# EAGLE design SushiBitsOne (EAGLE 8.2.1)
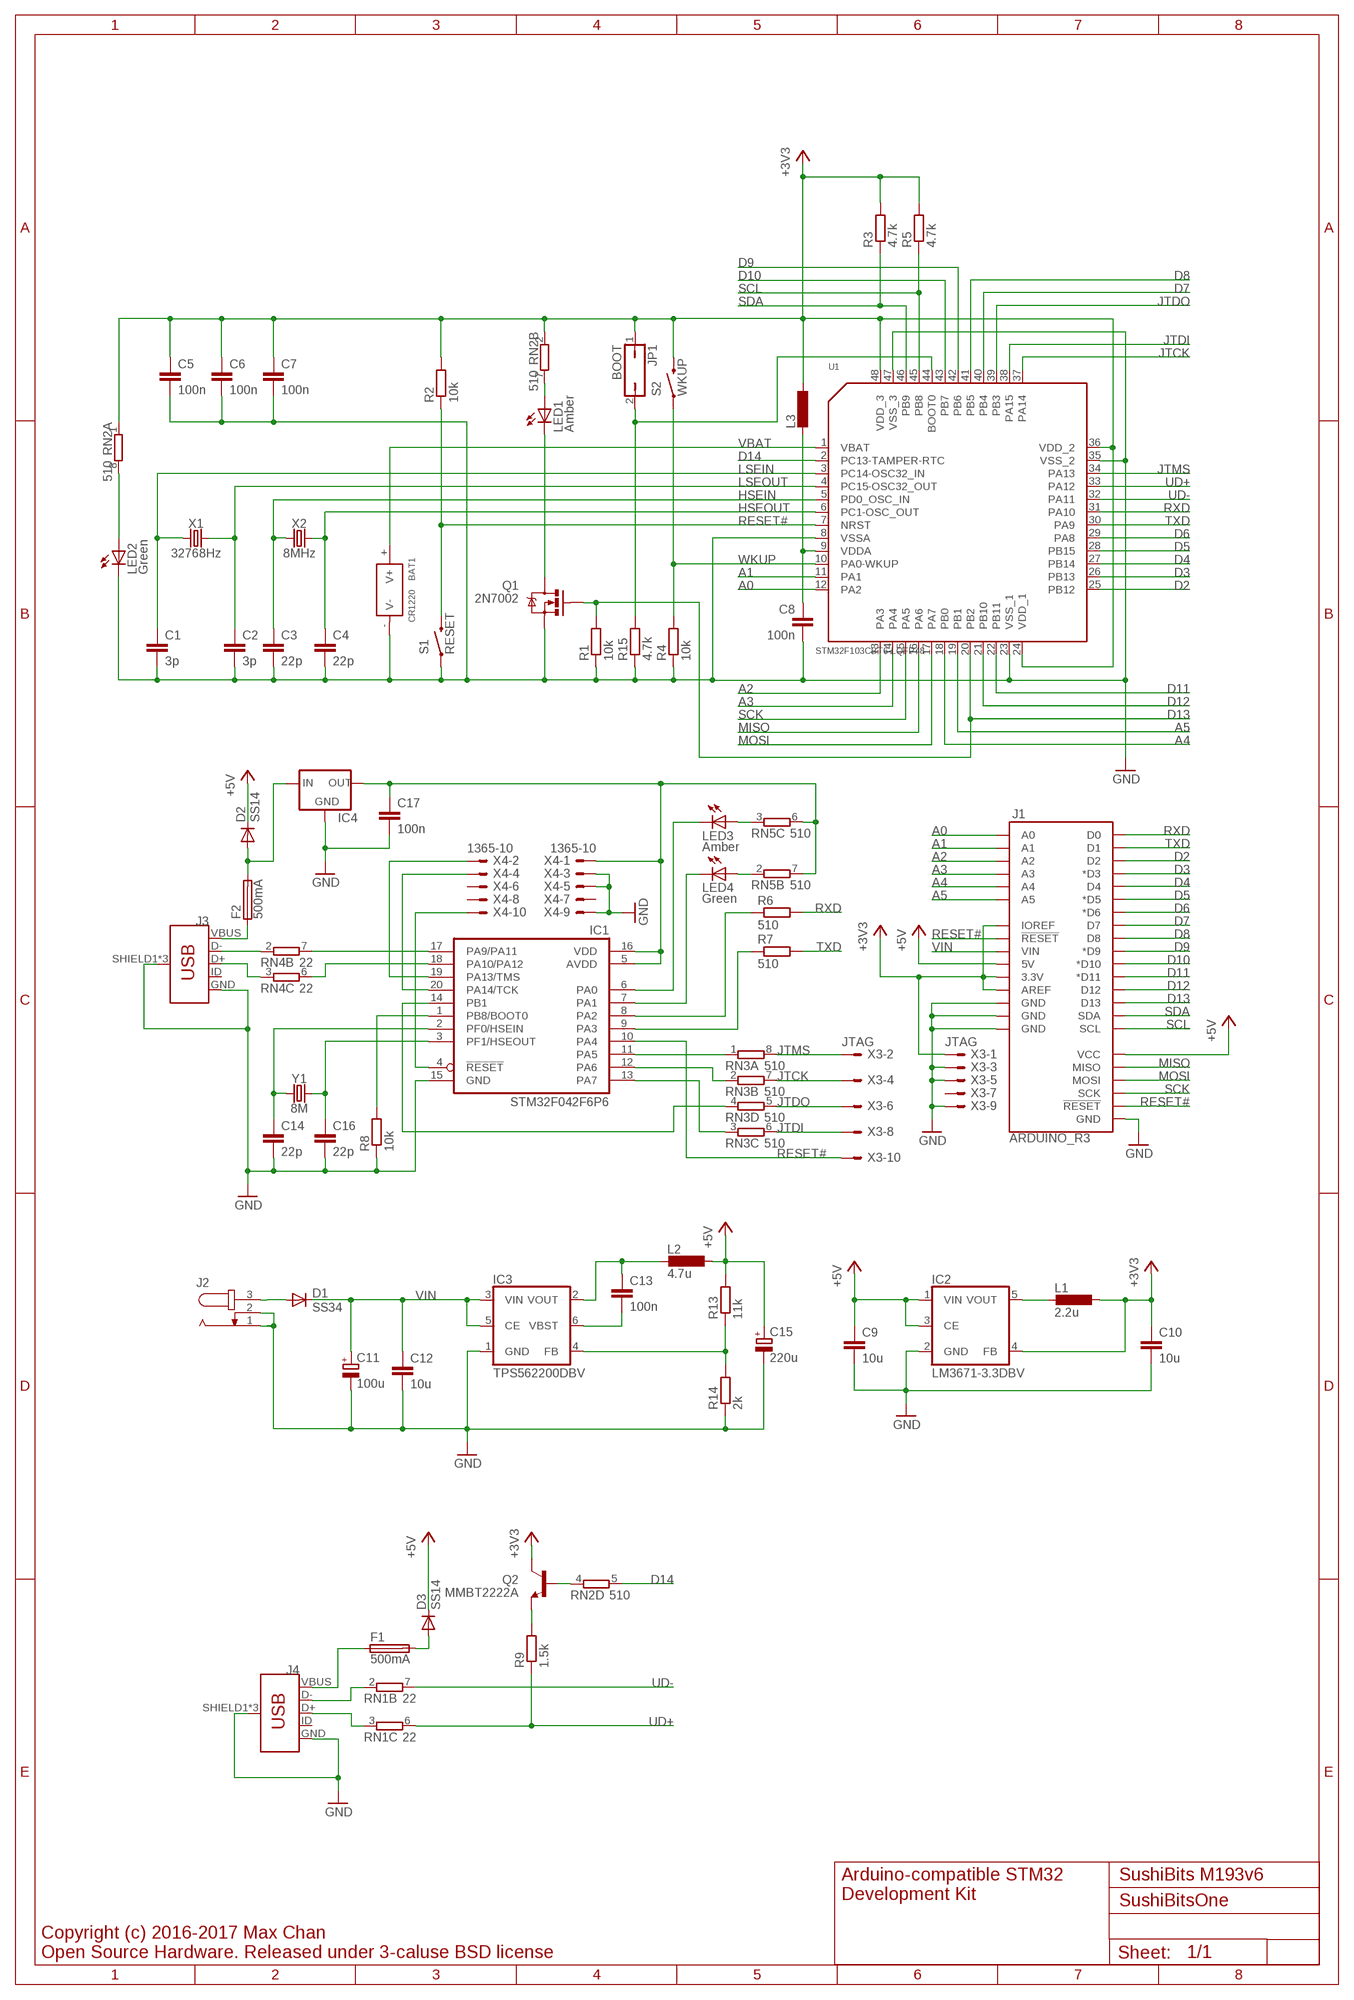
[diagram p0: schematic, sheet 1]

## Parts
BAT1  CR1220  SMD-BATTERY-CELL-HOLDER-PLASTIC  [BAT2P-SMD-16.4-CR1220]
C1  3p  C-EUC0603  [C0603]
C2  3p  C-EUC0603  [C0603]
C3  22p  C-EUC0603  [C0603]
C4  22p  C-EUC0603  [C0603]
C5  100n  C-EUC0603  [C0603]
C6  100n  C-EUC0603  [C0603]
C7  100n  C-EUC0603  [C0603]
C8  100n  C-EUC0603  [C0603]
C9  10u  C-EUC0805  [C0805]
C10  10u  C-EUC0805  [C0805]
C11  100u  CPOL-EUUD-8X10  [UD-8X10_NICHICON]
C12  10u  C-EUC0805  [C0805]
C13  100n  C-EUC0603  [C0603]
C14  22p  C-EUC0603  [C0603]
C15  220u  CPOL-EUSMCB  [SMC_B]
C16  22p  C-EUC0603  [C0603]
C17  100n  C-EUC0603  [C0603]
D1  SS34  DIODE-DO214AC  [DO214AC]
D2  SS14  DIODE-SOD123  [SOD123]
D3  SS14  DIODE-SOD123  [SOD123]
F1  500mA  FUSER0805  [R0805]
F2  500mA  FUSER0805  [R0805]
IC1  STM32F042F6P6  [TSSOP20]
IC2  LM3671-3.3DBV  [SOT23-5L]
IC3  TPS562200DBV  [SOT23-6L]
IC4  XC63FPM  [SOT23]
J1  ARDUINO_R3  [ARDUINO_R3]
J2  JACK-PLUG0  [SPC4077]
J3  USB_MICRO-B_FEMALE-SMT  [USB-B-MICRO-SMD]
J4  USB_MICRO-B_FEMALE-SMT  [USB-B-MICRO-SMD]
JP1  BOOT  JP1Q  [JP1]
L1  2.2u  L-EUL5650M  [L5650M]
L2  4.7u  L-EUL5650M  [L5650M]
L3  L-EUL2012C  [L2012C]
LED1  Amber  LEDCHIPLED_0805  [CHIPLED_0805]
LED2  Green  LEDCHIP-LED0805  [CHIP-LED0805]
LED3  Amber  LEDCHIP-LED0805  [CHIP-LED0805]
LED4  Green  LEDCHIP-LED0805  [CHIP-LED0805]
Q1  2N7002  MOSFET-NCHANNELBSS138  [SOT23-3]
Q2  MMBT2222A  TRANSISTOR_NPNMMBT2222A  [SOT23-3]
R1  10k  R-EU_R0603  [R0603]
R2  10k  R-EU_R0603  [R0603]
R3  4.7k  R-EU_R0603  [R0603]
R4  10k  R-EU_R0603  [R0603]
R5  4.7k  R-EU_R0603  [R0603]
R6  510  R-EU_R0603  [R0603]
R7  510  R-EU_R0603  [R0603]
R8  10k  R-EU_R0603  [R0603]
R9  1.5k  R-EU_R0603  [R0603]
R13  11k  R-EU_R0603  [R0603]
R14  2k  R-EU_R0603  [R0603]
R15  4.7k  R-EU_R0603  [R0603]
RN1  22  4R-NEXB38V  [EXB38V]
RN2  510  4R-NEXB38V  [EXB38V]
RN3  510  4R-NEXB38V  [EXB38V]
RN4  22  4R-NEXB38V  [EXB38V]
RN5  510  4R-NEXB38V  [EXB38V]
S1  RESET  SWITCH-MOMENTARY-2SMD-1101NE  [TACTILE-SWITCH-1101NE]
S2  WKUP  SWITCH-MOMENTARY-2SMD-1101NE  [TACTILE-SWITCH-1101NE]
U1  STM32F103CBT6-LQFP48  MCU-STM32F103CBT6(LQFP48)  [LQFP48-0.5-7X7MM]
X1  32768Hz  CRYSTALSMD-3.2X1.5  [CRYSTAL-SMD-3.2X1.5MM]
X2  8MHz  CRYSTALSMD-5X3.2-2PAD  [CRYSTAL-SMD-5X3.2-2PAD]
X3  JTAG  1365-10  [1365-10]
X4  1365-10  [1365-10]
Y1  8M  CRYSTALSMD-5X3.2-2PAD  [CRYSTAL-SMD-5X3.2-2PAD]

## Nets
+3V3: C5.1 C6.1 C7.1 C10.1 IC2.4(FB) J1.3.3V J1.AREF J1.IOREF JP1.1 L1.1 L3.1 Q2.3(C) R2.2 R3.2 R5.2 RN2.1 RN2.2 S2.2 U1.24(VDD_1) U1.36(VDD_2) U1.48(VDD_3) X3.1
+5V: C9.1 C15.+ D2.C D3.C IC2.1(VIN) IC2.3(CE) J1.5V J1.VCC L2.1 R13.2
A0: J1.A0 U1.12(PA2)
A1: J1.A1 U1.11(PA1)
A2: J1.A2 U1.13(PA3)
A3: J1.A3 U1.14(PA4)
A4: J1.A4 U1.18(PB0)
A5: J1.A5 U1.19(PB1)
D2: J1.D2 U1.25(PB12)
D3: J1.D3(*D3) U1.26(PB13)
D4: J1.D4 U1.27(PB14)
D5: J1.D5(*D5) U1.28(PB15)
D6: J1.D6(*D6) U1.29(PA8)
D7: J1.D7 U1.40(PB4)
D8: J1.D8 U1.41(PB5)
D9: J1.D9(*D9) U1.42(PB6)
D10: J1.D10(*D10) U1.43(PB7)
D11: J1.D11(*D11) U1.22(PB11)
D12: J1.D12 U1.21(PB10)
D13: J1.D13 Q1.1(G) R1.2 U1.20(PB2)
D14: RN2.5 U1.2(PC13-TAMPER-RTC)
GND: BAT1.-(V-) C1.2 C2.2 C3.2 C4.2 C5.2 C6.2 C7.2 C8.2 C9.2 C10.2 C11.- C12.2 C14.2 C15.- C16.2 C17.2 IC1.15(GND) IC2.2(GND) IC3.1(GND) IC4.1(GND) J1.GND@1(GND) J1.GND@2(GND) J1.GND@3(GND) J1.GND@4(GND) J2.1 J2.2 J3.GND J3.SHIELD1(SHIELD) J3.SHIELD2(SHIELD) J3.SHIELD3(SHIELD) J4.GND J4.SHIELD1(SHIELD) J4.SHIELD2(SHIELD) J4.SHIELD3(SHIELD) LED2.C Q1.2(S) R1.1 R4.1 R8.1 R14.1 R15.1 S1.1 U1.8(VSSA) U1.23(VSS_1) U1.35(VSS_2) U1.47(VSS_3) X3.3 X3.5 X3.9 X4.3 X4.5 X4.9
HSEIN: C3.1 U1.5(PD0_OSC_IN) X2.P$1
HSEOUT: C4.1 U1.6(PC1-OSC_OUT) X2.P$2
JTCK: RN3.7 U1.37(PA14) X3.4
JTDI: RN3.6 U1.38(PA15) X3.8
JTDO: RN3.5 U1.39(PB3) X3.6
JTMS: RN3.8 U1.34(PA13) X3.2
LSEIN: C1.1 U1.3(PC14-OSC32_IN) X1.P$1
LSEOUT: C2.1 U1.4(PC15-OSC32_OUT) X1.P$2
MISO: J1.MISO U1.16(PA6)
MOSI: J1.MOSI U1.17(PA7)
N$1: J4.D- RN1.2
N$2: J4.D+ RN1.3
N$3: IC1.17(PA9/PA11) RN4.7
N$4: IC1.18(PA10/PA12) RN4.6
N$5: IC1.8(PA2) R6.1
N$6: IC1.9(PA3) R7.1
N$7: LED2.A RN2.8
N$8: LED1.C Q1.3(D)
N$9: LED1.A RN2.7
N$10: IC2.5(VOUT) L1.2
N$11: D1.A J2.3
N$12: JP1.2 R15.2 U1.44(BOOT0)
N$13: D3.A F1.2
N$14: C13.1 IC3.2(VOUT) L2.2
N$15: C13.2 IC3.6(VBST)
N$16: D2.A F2.2 IC4.3(IN)
N$17: IC3.4(FB) R13.1 R14.2
N$18: Q2.2(E) R9.2
N$19: Q2.1(B) RN2.4
N$20: C8.1 L3.2 U1.9(VDDA)
N$21: IC1.4(!RESET) X4.10
N$22: J3.D+ RN4.3
N$23: J3.D- RN4.2
N$24: F2.1 J3.VBUS
N$25: IC1.20(PA14/TCK) X4.4
N$26: IC1.19(PA13/TMS) X4.2
N$27: C17.1 IC1.5(AVDD) IC1.16(VDD) IC4.2(OUT) RN5.6 RN5.7 X4.1
N$28: C14.1 IC1.2(PF0/HSEIN) Y1.P$1
N$29: C16.1 IC1.3(PF1/HSEOUT) Y1.P$2
N$30: IC1.11(PA5) RN3.1
N$31: IC1.12(PA6) RN3.2
N$32: IC1.13(PA7) RN3.3
N$33: IC1.14(PB1) RN3.4
N$34: IC1.1(PB8/BOOT0) R8.2
N$35: IC1.6(PA0) LED3.C
N$36: IC1.7(PA1) LED4.C
N$37: LED4.A RN5.2
N$38: LED3.A RN5.3
RESET#: IC1.10(PA4) J1.RESET@1(!RESET!) J1.RESET@2(!RESET!) R2.1 S1.2 U1.7(NRST) X3.10
RXD: J1.D0 R6.2 U1.31(PA10)
SCK: J1.SCK U1.15(PA5)
SCL: J1.SCL R5.1 U1.45(PB8)
SDA: J1.SDA R3.1 U1.46(PB9)
TXD: J1.D1 R7.2 U1.30(PA9)
UD+: R9.1 RN1.6 U1.33(PA12)
UD-: RN1.7 U1.32(PA11)
VBAT: BAT1.+(V+) U1.1(VBAT)
VBUS2: F1.1 J4.VBUS
VIN: C11.+ C12.1 D1.C IC3.3(VIN) IC3.5(CE) J1.VIN
WKUP: R4.2 S2.1 U1.10(PA0-WKUP)
Unconnected: J3.ID J4.ID RN1.1 RN1.4 RN1.5 RN1.8 RN2.3 RN2.6 RN4.1 RN4.4 RN4.5 RN4.8 RN5.1 RN5.4 RN5.5 RN5.8 X3.7 X4.6 X4.7 X4.8

## Notes on the sheet
- Arduino-compatible STM32
  Development Kit
- SushiBits M193v6
- Copyright (c) 2016-2017 Max Chan
  Open Source Hardware. Released under 3-caluse BSD license

## Library data of the parts
BAT1 = Seeed-OPL-Connector:SMD-BATTERY-CELL-HOLDER-PLASTIC: 320170000
C1-C10 C12-C14 C16 C17 = rcl:C-EU: CAPACITOR, European symbol
C11 C15 = rcl:CPOL-EU: POLARIZED CAPACITOR, European symbol
D1-D3 = diode:DIODE-: DIODE
F1 F2 = fuse:FUSE: Fuse
IC1 = HeadphoneBT:STM32F042F
IC2 = stm32f103c-dvk2:LM3671
IC3 = stm32f103c-dvk2:TPS56*200
IC4 = v-reg:XC63FP: Positiv Voltage Regulators www.torex.co.jp/english/product/pro02/pdf/0201_xc62fp.pdf
J1 = SparkFun-Boards:ARDUINO_R3: Arduino R3 Footprint (w/ SPI header)
J2 = con-jack:JACK-PLUG: DC POWER JACK Power Jack, DC, Right Angle, Through Hole, Rated 5A at 16VDC, PC Terminals Distributor: Farnell (www.Farnell.de) Drawing: 84N1161.pdf / 84N1162.pdf Manufacturer: SPC Technology (www.spctechnology.com) Type: SPC4077 / SPC 4078; OC_FARNELL: unknown; OC_NEWARK: unknown
J3 J4 = SparkFun-Connectors:USB_MICRO-B: USB Type Micro-B Connector Male/female and PTH/SMT variants SparkFun Products: SparkFun microB USB Breakout <https://www.sparkfun.com/products/12035> SparkFun USB microB Plug Breakout <https://www.sparkfun.com/products/10031> SparkFun ESP8266 Thing <https://www.sparkfun.com/products/13231>; PROD_ID: CONN-11752
JP1 = jumper:JP1Q: JUMPER
L1-L3 = rcl:L-EU: INDUCTOR, European symbol
LED1-LED4 = led:LED: LED OSRAM: - CHIPLED LG R971, LG N971, LY N971, LG Q971, LY Q971, LO R971, LY R971 LH N974, LH R974 LS Q976, LO Q976, LY Q976 LO Q996 - Hyper CHIPLED LW Q18S LB Q993, LB Q99A, LB R99A - SideLED LS A670, LO A670, LY A670, LG A670, LP A670 LB A673, LV A673, LT A673, LW A673 LH A674 LY A675 LS A676, LA A676, LO A676, LY A676, LW A676 LS A679, LY A679, LG A679 - Hyper Micro SIDELED® LS Y876, LA Y876, LO Y876, LY Y876 LT Y87S - SmartLED LW L88C, LW L88S LB L89C, LB L89S, LG L890 LS L89K, LO L89K, LY L89K LS L896, LA L896, LO L896, LY L896 - TOPLED LS T670, LO T670, LY T670, LG T670, LP T670 LSG T670, LSP T670, LSY T670, LOP T670, LYG T670 LG T671, LOG T671, LSG T671 LB T673, LV T673, LT T673, LW T673 LH T674 LS T676, LA T676, LO T676, LY T676, LB T676, LH T676, LSB T676, LW T676 LB T67C, LV T67C, LT T67C, LS T67K, LO T67K, LY T67K, LW E67C LS E67B, LA E67B, LO E67B, LY E67B, LB E67C, LV E67C, LT E67C LW T67C LS T679, LY T679, LG T679 LS T770, LO T770, LY T770, LG T770, LP T770 LB T773, LV T773, LT T773, LW T773 LH T774 LS E675, LA E675, LY E675, LS T675 LS T776, LA T776, LO T776, LY T776, LB T776 LHGB T686 LT T68C, LB T68C - Hyper Mini TOPLED® LB M676 - Mini TOPLED Santana® LG M470 LS M47K, LO M47K, LY M47K Source: http://www.osram.convergy.de LUXEON: - LUMILED® LXK2-PW12-R00, LXK2-PW12-S00, LXK2-PW14-U00, LXK2-PW14-V00 LXK2-PM12-R00, LXK2-PM12-S00, LXK2-PM14-U00 LXK2-PE12-Q00, LXK2-PE12-R00, LXK2-PE12-S00, LXK2-PE14-T00, LXK2-PE14-U00 LXK2-PB12-K00, LXK2-PB12-L00, LXK2-PB12-M00, LXK2-PB14-N00, LXK2-PB14-P00, LXK2-PB14-Q00 LXK2-PR12-L00, LXK2-PR12-M00, LXK2-PR14-Q00, LXK2-PR14-R00 LXK2-PD12-Q00, LXK2-PD12-R00, LXK2-PD12-S00 LXK2-PH12-R00, LXK2-PH12-S00 LXK2-PL12-P00, LXK2-PL12-Q00, LXK2-PL12-R00 Source: www.luxeon.com KINGBRIGHT: KA-3528ASYC Source: www.kingbright.com
Q1 = SparkFun-DiscreteSemi:MOSFET-NCHANNEL: Common NMOSFET Parts MFG P/N Store ID Prod ID FDD8780 TRANS-09984 SI7820DN TRANS-11055 FDS6630A IC-08089 2N7002PW TRANS-11151 FQP30N06L COM-10213 TRANS-10060 BSS123LT1G TRANS-08345 BSS138 TRANS-00830 BS170 2N7000; PROD_ID: TRANS-00830; VALUE: 200mA/50V
Q2 = SparkFun-DiscreteSemi:TRANSISTOR_NPN: Generic NPN BJT MMBT2222A - TRANS-08049 (SOT-23, 1A 40V) MPSA42 - TRANS-09116 (SOT-23, 500mA 300V) MMBT5088LT1G - TRANS-11160 (SOT-23, 50 mA 30V) BC547 - COM-08928 <http://www.sparkfun.com/products/8928> (TO-92 45V 100mA) (1.Collector 2.Base 3.Emitter) 2N3904 - COM-00521 <http://www.sparkfun.com/products/521> (TO-92 40V 200mA) (1.Emitter 2.Base 3.Collector) P2N2222A - COM-12852 <http://www.sparkfun.com/products/12852> (TO-92 40V 600mA) (1.Collector 2.Base 3.Emitter); PROD_ID: TRANS-08049
R1-R9 R13-R15 = rcl:R-EU_: RESISTOR, European symbol
RN1-RN5 = resistor-dil:4R-N: Array Chip Resistor Source: RS Component / Phycomp; OC_FARNELL: unknown; OC_NEWARK: unknown
S1 S2 = SparkFun-Electromechanical:SWITCH-MOMENTARY-2: Various NO switches- pushbuttons, reed, etc; PROD_ID: SWCH-00815
U1 = Seeed-OPL-ic:MCU-STM32F103CBT6(LQFP48): 310010004; MPN: STM32F103CBT6
X1 X2 Y1 = SparkFun-Clocks:CRYSTAL: Crystals (Generic) These are passive quartz crystals, which can be used as a clock source for a microcontroller. Crystal's are two-terminal devices. They require external "load" capacitors to generate an oscillating signal.
X3 X4 = con-leotronics:1365-10: DUAL ROW STRAIGHT HEADER 1364 SERIES. 1.27mm x 1.27mm. Without Fixing Post. SMT Source: http://www.leotronics.co.uk/Conexcon/Data%20Sheets/sec.%20A/1364ing.pdf; OC_FARNELL: unknown; OC_NEWARK: unknown

## Board
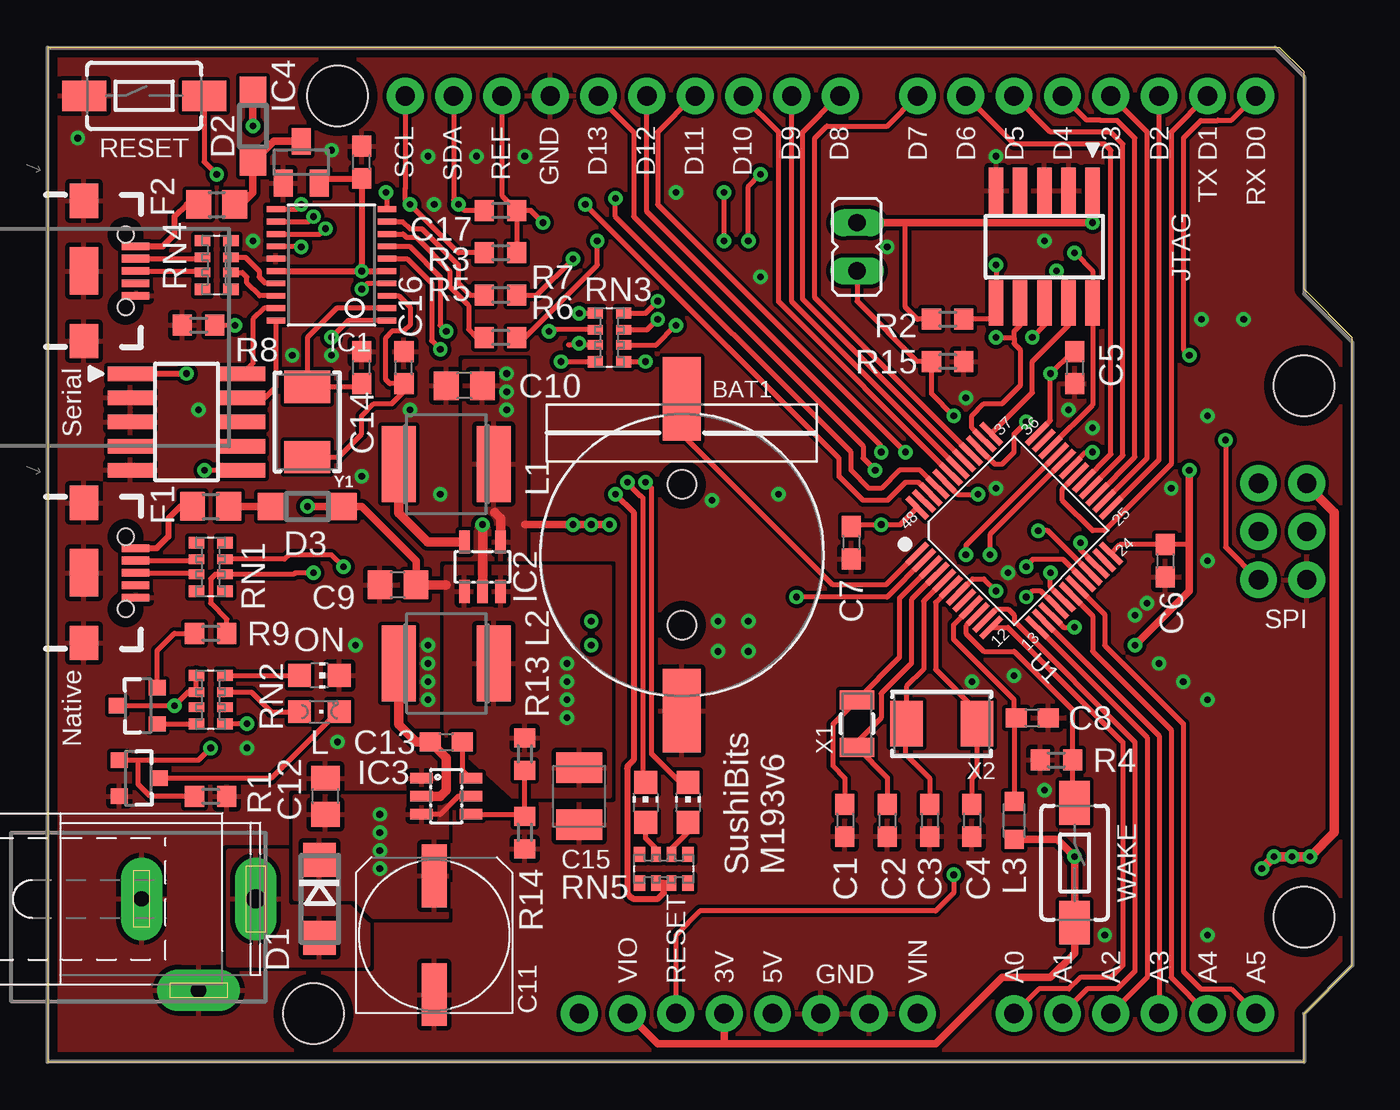
[diagram p1: board, top side]
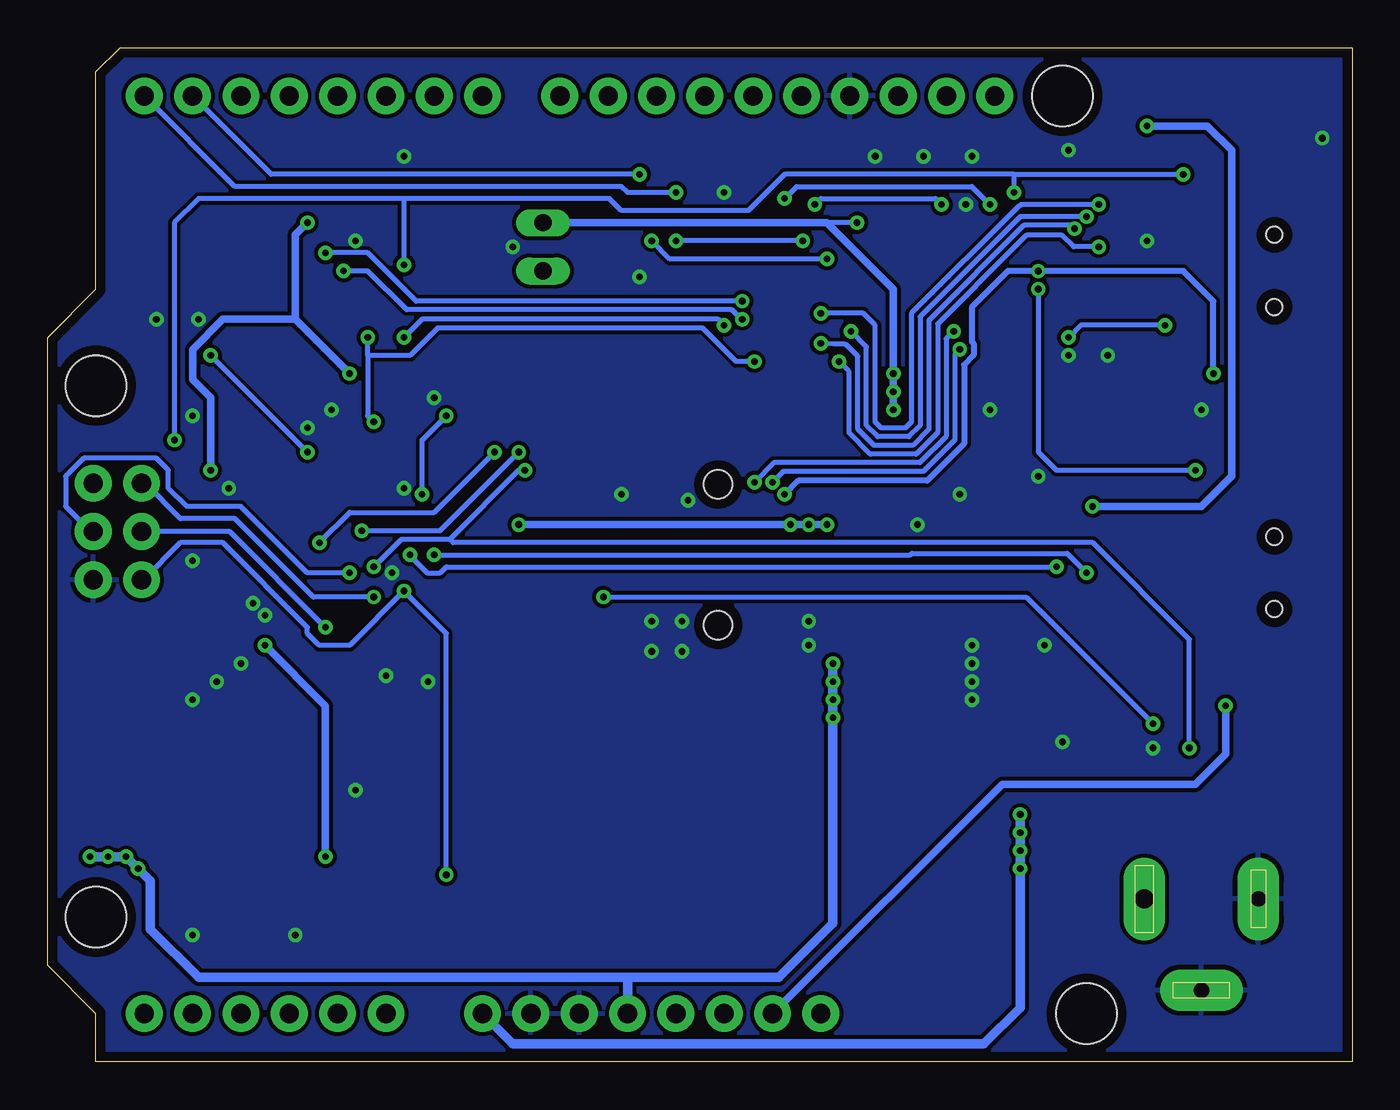
[diagram p2: board, bottom side, seen from below]

Size 68.58 x 53.34 mm. Coordinates in mm from the lower left corner, seen from the top.
Outline: 0,0 66.04,0 66.04,2.54 68.58,5.08 68.58,38.1 66.04,40.64 66.04,52.07 64.77,53.34 0,53.34 0,0
Copper layers (1*16): Top 0.035mm / dielectric 1.5mm / Bottom 0.035mm
Design rules "default *": minimum track width 10mil, minimum drill 20mil, track to track 8mil, track to pad 8mil, pad to pad 8mil, via to via 8mil, smd to smd 8mil, copper to edge 20mil, drill to drill 8mil, minimum pad ring 10mil, minimum via ring 8mil, stop-mask expansion 4mil, vias tented up to drill 0mil, thermal gap 10mil

### Footprints (pad centres in the part's own frame; a part is rotated, then mirrored left to right if it is on the bottom)
BAT2P-SMD-16.4-CR1220 = smd 2 x 4.4: + 0,-8.2; - 0,8.2 | hole 1.5: 0,3.7; 0,-3.7
C0603 = smd 1.1 x 1: 1 -0.85,0; 2 0.85,0
C0805 = smd 1.3 x 1.5: 1 -0.95,0; 2 0.95,0
UD-8X10_NICHICON = smd 3.3 x 1.3: + 3.125,0; - -3.125,0
SMC_B = smd 1.6 x 2.4: + -1.5,0; - 1.5,0
DO214AC = smd 1.8 x 1.7: A 2.05,0; C -2.05,0
SOD123 = smd 1.4 x 1.4: A 1.9,0; C -1.9,0
R0805 = smd 1.3 x 1.5: 1 -0.95,0; 2 0.95,0
TSSOP20 = smd 0.305 x 0.991: 1 -2.925,-2.918; 2 -2.275,-2.918; 3 -1.625,-2.918; 4 -0.975,-2.918; 5 -0.325,-2.918; 6 0.325,-2.918; 7 0.975,-2.918; 8 1.625,-2.918; 9 2.275,-2.918; 10 2.925,-2.918; 11 2.925,2.918; 12 2.275,2.918; 13 1.625,2.918; 14 0.975,2.918; 15 0.325,2.918; 16 -0.325,2.918; 17 -0.975,2.918; 18 -1.625,2.918; 19 -2.275,2.918; 20 -2.925,2.918
SOT23-5L = smd 0.55 x 1.2: 1 -0.95,-1.3; 2 0,-1.3; 3 0.95,-1.3; 4 0.95,1.3; 5 -0.95,1.3
SOT23-6L = smd 0.55 x 1.2: 1 -0.95,-1.3; 2 0,-1.3; 3 0.95,-1.3; 4 0.95,1.3; 5 0,1.3; 6 -0.95,1.3
SOT23 = smd 1 x 1.4: 1 -0.95,-1.1; 2 0.95,-1.1; 3 0,1.1
ARDUINO_R3 = drill 1.016 pad 1.93: 3.3V 35.56,2.54; 5V 38.1,2.54; A0 50.8,2.54; A1 53.34,2.54; A2 55.88,2.54; A3 58.42,2.54; A4 60.96,2.54; A5 63.5,2.54; AREF 23.876,50.8; D0 63.5,50.8; D1 60.96,50.8; D2 58.42,50.8; D3 55.88,50.8; D4 53.34,50.8; D5 50.8,50.8; D6 48.26,50.8; D7 45.72,50.8; D8 41.656,50.8; D9 39.116,50.8; D10 36.576,50.8; D11 34.036,50.8; D12 31.496,50.8; D13 28.956,50.8; GND@1 40.64,2.54; GND@2 43.18,2.54; GND@3 26.416,50.8; GND@4 66.18,25.35; IOREF 30.48,2.54; MISO 63.64,30.43; MOSI 66.18,27.89; NC 27.94,2.54; RESET@1 33.02,2.54; RESET@2 63.64,25.35; SCK 63.64,27.89; SCL 18.796,50.8; SDA 21.336,50.8; VCC 66.18,30.43; VIN 45.72,2.54 | hole 3.175: 15.24,50.8; 66.04,35.56; 66.04,7.62; 13.97,2.54
SPC4077 = drill 0.8 pad 2.184 long: 1 -3,0; 2 0,-4.8 | drill 1 pad 2.184 long: 3 3,0
USB-B-MICRO-SMD = smd 1.45 x 0.4: D+ 2.725,0; D- 2.725,0.65; GND 2.725,-1.3; ID 2.725,-0.65; VBUS 2.725,1.3 | smd 1.5 x 1.8: SHIELD1 0,3.685; SHIELD2 0,-3.685 | smd 1.5 x 2.5: SHIELD3 0,0 | hole 0.85: 2.2,1.9; 2.2,-1.9
JP1 = drill 0.914 long: 1 0,-1.27; 2 0,1.27
L5650M = smd 1.8 x 4: 1 -2.5,0; 2 2.5,0
L2012C = smd 1 x 1: 1 -1,0; 2 1,0
CHIPLED_0805 = smd 1.2 x 1.2: A 0,-1.05; C 0,1.05
CHIP-LED0805 = smd 1.2 x 1.2: A 0,-1.05; C 0,1.05
SOT23-3 = smd 0.8 x 0.9: 1 -0.95,-1; 2 0.95,-1; 3 0,1.1
R0603 = smd 1 x 1.1: 1 -0.85,0; 2 0.85,0
EXB38V = smd 0.6 x 0.8: 1 -1.275,-0.75; 4 1.275,-0.75; 5 1.275,0.75; 8 -1.275,0.75 | smd 0.5 x 0.8: 2 -0.4,-0.75; 3 0.4,-0.75; 6 0.4,0.75; 7 -0.4,0.75
TACTILE-SWITCH-1101NE = smd 2.3 x 1.6: 1 -3.15,0; 2 3.15,0
LQFP48-0.5-7X7MM = smd 1.5 x 0.3: 1 -4.45,2.75; 2 -4.45,2.25; 3 -4.45,1.75; 4 -4.45,1.25; 5 -4.45,0.75; 6 -4.45,0.25; 7 -4.45,-0.25; 8 -4.45,-0.75; 9 -4.45,-1.25; 10 -4.45,-1.75; 11 -4.45,-2.25; 12 -4.45,-2.75; 25 4.45,-2.75; 26 4.45,-2.25; 27 4.45,-1.75; 28 4.45,-1.25; 29 4.45,-0.75; 30 4.45,-0.25; 31 4.45,0.25; 32 4.45,0.75; 33 4.45,1.25; 34 4.45,1.75; 35 4.45,2.25; 36 4.45,2.75 | smd 0.3 x 1.5: 13 -2.75,-4.45; 14 -2.25,-4.45; 15 -1.75,-4.45; 16 -1.25,-4.45; 17 -0.75,-4.45; 18 -0.25,-4.45; 19 0.25,-4.45; 20 0.75,-4.45; 21 1.25,-4.45; 22 1.75,-4.45; 23 2.25,-4.45; 24 2.75,-4.45; 37 2.75,4.45; 38 2.25,4.45; 39 1.75,4.45; 40 1.25,4.45; 41 0.75,4.45; 42 0.25,4.45; 43 -0.25,4.45; 44 -0.75,4.45; 45 -1.25,4.45; 46 -1.75,4.45; 47 -2.25,4.45; 48 -2.75,4.45
CRYSTAL-SMD-3.2X1.5MM = smd 1 x 1.8: P$1 -1.25,0; P$2 1.25,0
CRYSTAL-SMD-5X3.2-2PAD = smd 1.7 x 2.4: P$1 1.85,0; P$2 -1.85,0
1365-10 = smd 0.76 x 2.4: 1 -2.54,-2.95; 2 -2.54,2.95; 3 -1.27,-2.95; 4 -1.27,2.95; 5 0,-2.95; 6 0,2.95; 7 1.27,-2.95; 8 1.27,2.95; 9 2.54,-2.95; 10 2.54,2.95

### Placement (x,y rotation side)
BAT1  33.34,26.67 180 top
C1  41.91,12.7 270 top
C2  44.13,12.7 270 top
C3  46.35,12.7 270 top
C4  48.58,12.7 270 top
C5  53.98,36.51 270 top
C6  58.74,26.35 270 top
C7  42.23,27.3 270 top
C8  51.75,18.1 0 top
C9  18.41,25.08 180 top
C10  21.91,35.56 180 top
C11  20.32,6.67 90 top
C12  14.61,13.97 90 top
C13  20.95,16.83 0 top
C14  16.51,36.51 90 top
C15  27.94,13.97 270 top
C16  18.73,36.51 90 top
C17  16.51,47.31 90 top
D1  14.29,8.57 270 top
D2  10.79,49.21 270 top
D3  13.65,29.21 180 top
F1  8.57,29.21 0 top
F2  8.89,45.09 0 top
IC1  14.92,41.91 90 top
IC2  22.86,26.04 0 top
IC3  20.95,13.97 270 top
IC4  13.34,47.31 0 top
J1  0,0 0 top
J2  7.94,8.57 0 top
J3  1.91,41.59 0 top
J4  1.91,25.72 0 top
JP1  42.55,42.86 180 top
L1  20.95,31.43 180 top
L2  20.95,20.95 180 top
L3  50.8,12.7 90 top
LED1  14.29,18.41 270 top
LED2  14.29,20.32 270 top
LED3  31.43,13.65 0 top
LED4  33.66,13.65 0 top
Q1  4.76,14.92 270 top
Q2  4.76,18.73 90 top
R1  8.57,13.97 180 top
R2  47.31,39.05 180 top
R3  23.81,44.77 0 top
R4  53.02,15.88 0 top
R5  23.81,42.55 0 top
R6  23.81,38.1 0 top
R7  23.81,40.32 0 top
R8  7.94,38.73 0 top
R9  8.57,22.54 180 top
R13  25.08,16.19 90 top
R14  25.08,12.06 90 top
R15  47.31,36.83 180 top
RN1  8.57,26.04 270 top
RN2  8.57,19.05 270 top
RN3  29.53,38.1 270 top
RN4  8.89,41.91 270 top
RN5  32.38,10.16 180 top
S1  5.08,50.8 0 top
S2  53.98,10.48 270 top
U1  50.8,27.94 45 top
X1  42.55,17.78 270 top
X2  46.99,17.78 180 top
X3  52.39,42.86 180 top
X4  7.3,33.66 270 top
Y1  13.65,33.66 90 top

### Tracks (layer width: path | path; a pad name or v marks a point on that pad's centre or on a via)
+3V3  (via drill 0.35)
  Top 0.254: U1.36 52.7,33.73 v52.7,36.2 53.87,37.36 C5.1 | 60.01,30.85 v60.01,31.11 | Q2.3 v6.67,18.73 7.38,19.45 RN2.2 RN2.1 7.82,20.52 | U1.48 44.82,28.26 v43.81,28.26 42.33,28.26 C7.1 | U1.24 56.36,27.2 C6.1 59.91,27.2 60.01,27.3 | R3.2 R5.2 | v26.04,44.13 25.4,44.77 R3.2 | J1.AREF 23.88,45.55 R3.2 | R2.2 45.72,39.05 45.09,39.69 45.09,44.13
  Top 0.406: X3.1 v54.93,44.13 45.09,44.13 JP1.1 | L3.1 53.07,11.7 v53.98,10.79 S2.2 53.98,5.71 52.7,4.45 50.16,4.45 46.67,0.95 35.56,0.95 | v60.01,31.11 60.01,27.3 60.01,24.77 v57.15,21.91 | J1.IOREF 32.07,0.95 35.56,0.95 | J1.3.3V 35.56,0.95 | v29.53,28.26 25.08,28.26
  Top 0.508: IC2.4 23.81,28.58 23.5,28.89
  Bottom 0.254: v26.04,44.13 27.62,44.13
  Bottom 0.406: v54.93,44.13 55.56,43.5 55.56,39.05 | v52.7,36.2 55.56,39.05 | 55.56,39.05 59.37,39.05 60.96,37.47 60.96,35.88 60.01,34.92 v60.01,31.11 | JP1.1 27.62,44.13 25.24,41.75 24.13,40.64 v24.13,36.2 v24.13,35.24 v24.13,34.29 | v57.15,21.91 53.98,18.73 v53.98,10.79 | v6.67,18.73 6.67,16.19 8.26,14.61 18.41,14.61 J1.IOREF | v43.81,28.26 v29.53,28.26 v28.57,28.26 v27.62,28.26
  pour Top (rank 2): 21.91,36.83 21.91,26.04 25.08,26.04 25.08,36.83
+5V  (via drill 0.35)
  Top 0.406: C9.1 19.36,26.36 16.51,29.21 15.56,29.21 D3.C v13.65,29.21 | D2.C v10.79,49.21
  Top 0.508: J1.VCC 66.18,30.34 67.63,28.89 67.63,12.06 v66.36,10.79 | v66.36,10.79 v65.41,10.79 v64.45,10.79 | v63.82,10.16 v64.45,10.79 | v64.45,10.79 v66.36,10.79 | 20.95,25.08 C9.1
  Bottom 0.406: v10.79,49.21 7.62,49.21 6.35,47.94 6.35,30.8 7.94,29.21 v13.65,29.21
  Bottom 0.508: v27.3,20.95 v27.3,20 v27.3,19.05 v27.3,18.1 27.3,7.3 30.16,4.45 38.1,4.45 | 38.1,4.45 60.64,4.45 63.18,6.99 63.18,9.53 v63.82,10.16 v64.45,10.79 v66.36,10.79 | J1.5V 38.1,4.45
  pour Top: 20.95,26.04 29.53,26.04 29.53,13.97 24.45,13.97 20.95,17.14
A0
  Top 0.254: U1.12 50.47,22.86 56.52,16.82 56.52,5.08 55.88,4.45 54.29,4.45 53.68,3.83 52.09,3.83 J1.A0
A1
  Top 0.254: U1.11 49.86,23.82 50.16,23.82 50.16,23.81 50.48,23.81 50.8,23.5 50.8,23.18 57.15,16.83 57.15,4.76 56.22,3.83 54.63,3.83 J1.A1
A2
  Top 0.254: U1.13 57.78,17.07 57.78,4.45 J1.A2
A3
  Top 0.254: U1.14 58.42,17.14 J1.A3
A4
  Top 0.254: U1.18 54.93,23.46 54.93,21.59 59.05,17.46 59.05,4.45 J1.A4
A5
  Top 0.254: U1.19 55.56,23.53 55.56,21.91 59.69,17.78 59.69,4.76 60.62,3.83 62.2,3.83 J1.A5
D2
  Top 0.254: U1.25 58.42,31.67 J1.D2
D3
  Top 0.254: U1.26 57.78,31.74 57.78,48.9 J1.D3
D4
  Top 0.254: U1.27 57.15,31.82 57.15,48.58 56.22,49.51 55.34,49.51 55.32,49.53 54.61,49.53 J1.D4
D5
  Top 0.254: U1.28 56.52,31.89 56.52,48.26 55.88,48.9 52.7,48.9 J1.D5
D6
  Top 0.254: U1.29 55.88,31.96 55.88,47.94 55.56,48.26 50.8,48.26 J1.D6
D7
  Top 0.254: J1.D7 44.13,49.21 40.96,49.21 40.32,48.58 40.32,40.19 U1.40
D8
  Top 0.254: U1.41 39.69,40.11 39.69,48.9 41.59,50.8 J1.D8
D9
  Top 0.254: U1.42 39.12,39.98 J1.D9
D10
  Top 0.254: U1.43 38.42,39.97 38.42,48.9 36.58,50.74 J1.D10
D11  (via drill 0.35)
  Top 0.254: U1.22 54.29,26.92 v54.29,27.3 | J1.D11 33.97,50.8 32.07,48.9 32.07,45.09 v45.09,32.07
  Bottom 0.254: v54.29,27.3 52.7,28.89 48.26,28.89 v45.09,32.07
D12  (via drill 0.35)
  Top 0.254: U1.21 52.57,27.94 v52.07,27.94 | J1.D12 31.5,44.7 43.81,32.38 v43.81,32.07
  Bottom 0.254: v43.81,32.07 47.94,27.94 v52.07,27.94
D13  (via drill 0.35)
  Top 0.254: U1.20 53.38,26.43 51.78,26.43 51.44,26.08 v51.44,26.04 | J1.D13 28.96,50.74 30.8,48.9 30.8,44.45 42.86,32.38 42.86,31.75 v43.5,31.11 | R1.2 5.4,13.97 4.76,14.61 4.76,15.88 | Q1.1 4.76,15.87 4.76,15.88 | 4.76,15.88 7.94,15.88 v8.57,16.51
  Bottom 0.254: v51.44,26.04 49.99,27.48 47.45,27.48 | v8.57,16.51 8.57,22.23 13.65,27.3 47.27,27.3 47.45,27.48 | v43.5,31.11 43.81,31.11 47.45,27.48
D14  (via drill 0.35)
  Top 0.254: U1.2 44.13,24.45 v39.37,24.45 | v10.48,17.78 RN2.5
  Bottom 0.254: v39.37,24.45 17.14,24.45 v10.48,17.78
GND  (via drill 0.35)
  Top 0.508: IC2.2 v22.86,28.26
  other vias: 53.66,34.29 49.85,47.62 52.39,14.29 52.39,43.18 37.47,41.27 50.8,20.32 48.58,20 44.13,42.86 49.85,30.16 60.64,39.05 57.15,23.5 57.78,24.13 59.05,30.16 50.48,25.72 33.02,45.72 22.54,47.62 25.08,47.62 20,47.62 54.93,33.34 10.48,16.51 55.56,6.67 60.96,6.67 58.42,20.95 59.69,20 60.96,19.05 62.87,39.05 60.96,33.97 60.96,26.35 48.26,34.92 12.86,37.15 14.92,37.15 19.05,34.29 20,19.05 20,20 20,20.95 20,21.91 14.92,47.94 10.79,43.18 20.32,45.09 35.24,21.59 36.83,21.59 36.83,23.18 20.64,29.84 16.51,30.8 38.42,29.84 34.92,29.53 35.24,23.18 28.57,23.18 28.57,21.91 16.19,21.91 15.24,16.83 7.94,34.29 1.59,48.58
  pour Top (rank 6): 0,53.34 64.45,53.34 66.04,51.75 66.04,40.64 68.9,37.78 68.9,5.4 66.04,2.54 66.04,0 0,0
  pour Bottom (rank 6): 0,0 0,53.02 0.32,53.34 64.45,53.34 66.04,51.75 66.04,40.96 66.36,40.64 66.36,40.32 68.58,38.1 68.58,5.08 66.04,2.54 66.04,0.32 66.99,0.32
HSEIN
  Top 0.254: U1.5 46.04,24.24 46.04,20.64 45.14,19.74 X2.P$1 45.09,17.73 45.09,16.19 46.35,14.92 C3.1
HSEOUT
  Top 0.254: U1.6 46.67,24.17 46.67,20.64 48.84,18.47 X2.P$2 48.84,15.19 48.58,14.92 C4.1
JTCK  (via drill 0.35)
  Top 0.254: U1.37 51.75,35.19 51.75,36.83 53.66,38.73 X3.4 53.66,40.96 v53.02,41.59 | RN3.7 31.52,38.5 v32.07,39.05
  Bottom 0.254: v32.07,39.05 32.31,39.3 32.36,39.3 32.61,39.55 49.71,39.55 51.75,41.59 v53.02,41.59
JTDI  (via drill 0.35)
  Top 0.254: U1.38 48.58,33.34 48.58,33.97 49.21,34.61 50.16,34.61 51.12,35.56 51.12,37.47 50.8,37.78 50.8,38.1 | X3.8 51.12,38.73 50.8,38.42 50.8,38.1 | RN3.6 31.98,37.7 v33.02,38.73 | v49.85,38.1 50.8,38.1
  Bottom 0.254: v33.02,38.73 33.34,39.05 48.9,39.05 v49.85,38.1
JTDO  (via drill 0.35)
  Top 0.254: X3.6 52.39,38.73 v51.75,38.1 | v51.44,33.66 50.8,33.02 50.8,32.07 50.16,31.43 49.78,31.43 U1.39 | RN3.5 v31.43,36.83
  Bottom 0.254: 51.75,37.15 v51.75,38.1 | 51.75,37.15 51.75,33.97 v51.44,33.66 | v31.43,36.83 32.38,36.83 34.15,38.59 48.08,38.59 49.53,37.15 51.75,37.15
JTMS  (via drill 0.35)
  Top 0.254: U1.34 54.93,34.54 X3.2 54.93,41.59 v53.98,42.55 | RN3.8 31.44,39.38 v32.07,40.01
  Bottom 0.254: v32.07,40.01 49.21,40.01 51.75,42.55 v53.98,42.55
LSEIN
  Top 0.254: U1.3 44.77,24.38 44.77,21.27 42.55,19.05 X1.P$1 41.27,17.76 41.27,15.56 41.91,14.92 C1.1
LSEOUT
  Top 0.254: U1.4 45.4,24.31 45.4,20.95 43.81,19.37 43.81,18.1 42.55,16.83 X1.P$2 44.13,14.94 C2.1
MISO  (via drill 0.35)
  Top 0.254: U1.16 52.21,24.77 51.75,24.77 v51.44,24.45
  Bottom 0.254: v51.44,24.45 54.61,24.45 58.74,28.57 61.59,28.57 63.45,30.43 J1.MISO
MOSI  (via drill 0.35)
  Top 0.254: U1.17 52.7,24.97 v52.7,25.72
  Bottom 0.254: v52.7,25.72 54.93,25.72 58.42,29.21 61.28,29.21 62.23,30.16 62.23,31.11 62.87,31.75 66.67,31.75 66.7,31.73 66.72,31.73 67.47,30.97 67.47,30.95 67.63,30.8 67.63,29.21 66.31,27.89 J1.MOSI
N$1
  Top 0.254: 7.75,26.37 RN1.2 7.75,26.37 | J4.D- 7.75,26.37
N$2
  Top 0.254: 7.74,25.72 RN1.3 7.74,25.72 | J4.D+ 7.74,25.72
N$3
  Top 0.254: RN4.7 10.39,42.31 11.11,41.59 11.11,41.27 11.43,40.96 11.75,40.96 11.77,40.94 IC1.17
N$4
  Top 0.254: RN4.6 10.24,41.51 10.48,41.27 10.48,40.96 11.15,40.28 IC1.18
N$5
  Top 0.254: IC1.8 18.68,43.53 18.86,43.36 19.37,43.36 21.13,41.59 21.13,40.77 22.04,39.87 22.05,39.87 22.13,39.78 22.13,38.51 22.54,38.1 R6.1
N$6
  Top 0.254: IC1.9 18.68,44.19 19.05,43.81 19.67,43.81 21.4,42.09 21.41,42.09 21.59,41.91 21.59,40.96 22.23,40.32 R7.1
N$7
  Top 0.254: RN2.8 LED2.A
N$8
  Top 0.254: LED1.C 15.24,18.41 11.75,14.92 Q1.3
N$9
  Top 0.254: RN2.7 10.71,19.45 11.75,18.41 LED1.A
N$10
  Top 0.508: IC2.5 19.97,27.34 18.45,28.85 L1.2
N$11
  pour Top (rank 2): 9.84,11.11 12.7,11.11 12.7,8.26 15.88,8.26 16.83,7.3 16.83,5.08 9.53,5.08 9.53,11.11
N$12  (via drill 0.35)
  Top 0.254: R15.2 45.72,36.83 42.55,40.01 JP1.2 | U1.44 47.83,29.84 v48.9,29.84 | v47.62,33.97 46.46,35.14 R15.2 | R15.2 46.67,36.83 R15.2
  Bottom 0.254: v48.9,29.84 48.9,32.7 v47.62,33.97
N$13
  Top 0.406: F1.2 D3.A
N$14
  Top 0.508: IC3.2 20.64,13.97 20.95,14.29 20.95,15.98 C13.1 19.37,16.83 18.45,17.74 L2.2
N$15
  Top 0.254: C13.2 21.8,15.37 IC3.6
N$16
  Top 0.406: F2.2 10.16,45.09 10.79,45.72 D2.A 11.89,48.41 IC4.3
N$17
  Top 0.254: R13.1 R14.2 24.98,13.02 IC3.4
N$18
  Top 0.254: Q2.2 5.76,21.64 6.67,22.54 R9.2
N$19
  Top 0.254: Q2.1 RN2.4
N$20
  Top 0.254: 50.8,18.41 L3.2 | 50.8,18.41 50.8,19.05 47.62,22.23 47.62,23 U1.9 | C8.1 50.8,18.41
N$21  (via drill 0.35)
  Top 0.254: IC1.4 16.8,40.94 v16.51,40.64 | v8.26,31.11 X4.10
  Bottom 0.254: v16.51,40.64 16.51,32.07 15.56,31.11 v8.26,31.11
N$22
  Top 0.254: 8.06,41.59 RN4.3 8.06,41.59 | J3.D+ 8.06,41.59
N$23
  Top 0.254: 8.07,42.24 RN4.2 8.07,42.24 | J3.D- 8.07,42.24
N$24
  Top 0.305: F2.1 7.3,45.09 6.67,44.45 6.67,43.5 6.06,42.89 J3.VBUS
N$25
  Top 0.254: IC1.20 12.01,35.5 11.43,34.92 X4.4
N$26
  Top 0.254: IC1.19 11.38,39.63 10.79,39.05 10.79,36.74 X4.2
N$27  (via drill 0.35)
  Top 0.305: IC1.16 v16.51,41.59 | v16.51,41.59 IC1.5 | X4.1 v7.3,36.2 | IC4.2 14.54,46.46 C17.1 v16.51,41.59 | v29.84,29.84 30.8,28.89 30.8,15.88 30.48,15.56 30.48,15.45 30.45,15.43 30.45,8.86 30.66,8.65 30.72,8.65 30.8,8.57 32.07,8.57 32.38,8.89 32.38,9.41 | 32.38,9.41 RN5.6 | 32.38,9.41 RN5.7
  Bottom 0.305: v7.3,36.2 7.3,40.01 8.89,41.59 13.33,41.59 v16.51,41.59 18.11,41.59 20,39.69 20,37.87 19.9,37.77 19.9,37.16 20.41,36.66 20.41,32.51 22.35,30.57 29.12,30.57 v29.84,29.84
N$28
  Top 0.254: C14.1 16.35,35.51 Y1.P$1 13.65,38.1 15.19,39.63 IC1.2
N$29
  Top 0.254: Y1.P$2 15.29,31.8 16.51,33.02 16.51,33.97 17.14,34.61 18.1,34.61 18.73,35.24 C16.1 18,35.66 17.78,35.88 17.78,38.1 18.1,38.42 18.73,38.42 19.05,38.73 19.05,39.69 18.45,40.28 IC1.3
N$30  (via drill 0.35)
  Top 0.254: IC1.11 13.09,44.84 v13.34,45.09 | v27.94,39.37 RN3.1
  Bottom 0.254: v27.94,39.37 25.72,39.37 25.08,38.73 25.08,33.66 24.77,33.34 23.5,33.34 23.18,33.66 23.18,39.37 17.54,45.01 17.49,45.01 17.41,45.09 v13.34,45.09
N$31  (via drill 0.35)
  Top 0.254: IC1.12 13.71,44.19 v13.97,44.45 | RN3.2 26.43,38.5 v26.35,38.42
  Bottom 0.254: v13.97,44.45 17.45,44.45 22.72,39.18 22.72,33.47 23.31,32.88 24.95,32.88 25.54,33.47 25.54,37.6 v26.35,38.42
N$32  (via drill 0.35)
  Top 0.254: IC1.13 14.32,43.53 v14.61,43.81 | RN3.3 27.39,37.7 v27.94,37.78
  Bottom 0.254: v14.61,43.81 14.78,43.99 17.26,43.99 22.26,38.99 22.26,33.28 23.12,32.42 25.14,32.42 26,33.28 26,37.11 26.6,37.71 26.65,37.71 26.7,37.76 27.28,37.76 v27.94,37.78
N$33  (via drill 0.35)
  Top 0.254: IC1.14 13.31,42.88 v13.34,42.86 | v26.99,36.83 RN3.4
  Bottom 0.254: v13.34,42.86 14.65,42.86 15.27,43.47 17.14,43.47 17.76,42.84 21.81,38.8 21.81,33.09 22.93,31.97 25.33,31.97 26.45,33.09 26.45,36.3 v26.99,36.83
N$34  (via drill 0.35)
  Top 0.254: R8.2 v9.84,38.73 | IC1.1 15.81,38.98 v14.92,38.1
  Bottom 0.254: v9.84,38.73 14.29,38.73 v14.92,38.1
N$35  (via drill 0.35)
  Top 0.254: IC1.6 18.9,42.23 20.18,40.96 20.18,37.92 v20.64,37.47 | v30.48,30.48 30.72,30.24 30.72,30.19 31.14,29.77 31.19,29.77 31.29,29.67 31.29,14.84 LED3.C
  Bottom 0.254: v20.64,37.47 20.89,37.21 20.89,32.71 22.55,31.05 29.91,31.05 v30.48,30.48
N$36  (via drill 0.35)
  Top 0.254: IC1.7 19.03,42.88 20.64,41.27 20.64,38.73 v20.95,38.42 | v31.43,30.48 31.75,30.16 31.75,16.19 33.24,14.7 LED4.C
  Bottom 0.254: v20.95,38.42 21.35,38.02 21.35,32.9 22.74,31.51 30.4,31.51 v31.43,30.48
N$37
  Top 0.254: RN5.2 32.78,11.2 33.22,11.64 33.23,11.64 33.66,12.06 LED4.A
N$38
  Top 0.254: RN5.3 31.98,11.2 31.55,11.64 31.54,11.64 31.43,11.75 LED3.A
RESET#  (via drill 0.35)
  Top 0.254: U1.7 48.61,25.4 49.21,25.4 v49.85,24.77 | v61.91,32.7 61.91,27.08 J1.RESET@2 | v47.62,9.84 47.62,8.89 46.67,7.94 34.29,7.94 33.02,6.67 J1.RESET@1 | S1.2 8.23,47.33 v8.89,46.67 | v49.85,41.91 X3.10 49.85,39.37 49.53,39.05 R2.1 | IC1.10 17.84,45.66 v17.78,45.72
  Bottom 0.254: J1.RESET@2 63.55,25.35 61.59,27.3 59.37,27.3 54.93,22.86 54.93,22.54 54.29,21.91 52.7,21.91 v49.85,24.77 47.62,22.54 v47.62,9.84 | 49.85,45.4 v49.85,41.91 | 49.85,45.4 60.64,45.4 61.91,44.13 v61.91,32.7 | 17.78,46.67 v8.89,46.67 | 17.78,46.67 29.84,46.67 31.75,44.77 38.42,44.77 39.05,45.4 49.85,45.4 | v17.78,45.72 17.78,46.67
RXD  (via drill 0.35)
  Top 0.254: U1.31 54.57,32.07 v54.93,32.07 | J1.D0 62.23,49.53 61.52,49.53 61.5,49.51 60.62,49.51 59.69,48.58 59.69,37.47 v60.01,37.15 | v35.56,43.18 v35.56,45.72 | R6.2 25.08,38.1 28.89,41.91 v28.89,43.18
  Bottom 0.254: v54.93,32.07 v60.01,37.15 | v28.89,43.18 v35.56,43.18 | v35.56,45.72 38.1,45.72 38.42,46.04 58.74,46.04 J1.D0
SCK  (via drill 0.35)
  Top 0.254: U1.15 53.41,22.86 v53.98,22.86
  Bottom 0.254: v53.98,22.86 59.01,27.89 J1.SCK
SCL  (via drill 0.35)
  Top 0.254: J1.SCL 18.8,45.93 18.8,45.92 18.8,45.33 v19.05,45.09 21.59,42.55 R5.1 | U1.45 45.86,31.11 44.77,31.11 43.81,30.16 43.18,30.16 42.23,31.11 42.23,32.07 29.84,44.45 v29.84,45.4
  Bottom 0.254: v29.84,45.4 29.21,46.04 20,46.04 v19.05,45.09
SDA  (via drill 0.35)
  Top 0.254: J1.SDA 21.34,45.34 v21.59,45.09 21.91,44.77 R3.1 | U1.46 45.78,30.48 45.09,30.48 44.13,29.53 42.86,29.53 41.59,30.8 41.59,31.75 v28.26,45.09
  Bottom 0.254: v28.26,45.09 27.94,45.4 21.91,45.4 v21.59,45.09
TXD  (via drill 0.35)
  Top 0.254: J1.D1 59.05,48.9 59.05,31.43 55.56,27.94 54.93,27.94 53.34,29.53 53.34,30.13 U1.30 | v36.83,43.18 36.83,46.04 v37.47,46.67 | R7.2 25.72,40.32 v27.62,42.23
  Bottom 0.254: v27.62,42.23 35.88,42.23 v36.83,43.18 | J1.D1 56.83,46.67 v37.47,46.67
UD+  (via drill 0.35)
  Top 0.254: R9.1 9.42,23.28 8.57,24.13 8.57,25.4 8.81,25.64 RN1.6 12.94,25.64 13.02,25.72 v13.97,25.72 | U1.33 48.26,27.17 v48.26,26.67
  Bottom 0.254: v48.26,26.67 23.23,26.67 23.15,26.74 15,26.74 v13.97,25.72
UD-  (via drill 0.35)
  Top 0.254: U1.32 49.53,27.73 v49.53,26.67 | v15.56,26.04 14.92,26.67 12.7,26.67 12.46,26.43 RN1.7
  Bottom 0.254: v49.53,26.67 49.29,26.43 49.29,26.38 48.63,25.72 47.94,25.72 47.62,26.04 v15.56,26.04
VBAT
  Top 0.254: U1.1 44.05,25.08 41.27,25.08 33.34,33.02 BAT1.+
VBUS2
  Top 0.305: F1.1 6.99,29.21 6.35,28.57 6.35,27.62 5.75,27.02 J4.VBUS
VIN  (via drill 0.35)
  Top 0.254: IC3.5 21.59,13.97 20.64,13.02 IC3.3
  Bottom 0.508: J1.VIN 44.13,0.95 19.37,0.95 17.46,2.86 v17.46,10.16 v17.46,11.11 v17.46,12.06 v17.46,13.02
  pour Top: 13.02,13.97 20.95,13.97 20.95,7.62 17.14,7.62 16.19,8.57 13.02,8.57
WKUP
  Top 0.254: U1.10 48.26,22.93 48.26,22.54 49.21,21.59 50.8,21.59 53.87,18.52 R4.2 53.87,14.37 S2.1

### Text on the board
tPlace: RESET | SCL | SDA | REF | GND | D13 | D12 | D11 | D10 | D9 | D8 | D7 | D6 | D5 | D4 | D3 | D2 | TX D1 | RX D0 | JTAG | Serial | SPI | ON | Native | L | SushiBits / M193v6 | WAKE | VIO | RESET | 3V | 5V | GND | VIN | A0 | A1 | A2 | A3 | A4 | A5